# EAGLE schematic RouterPi (EAGLE 9.6.2)
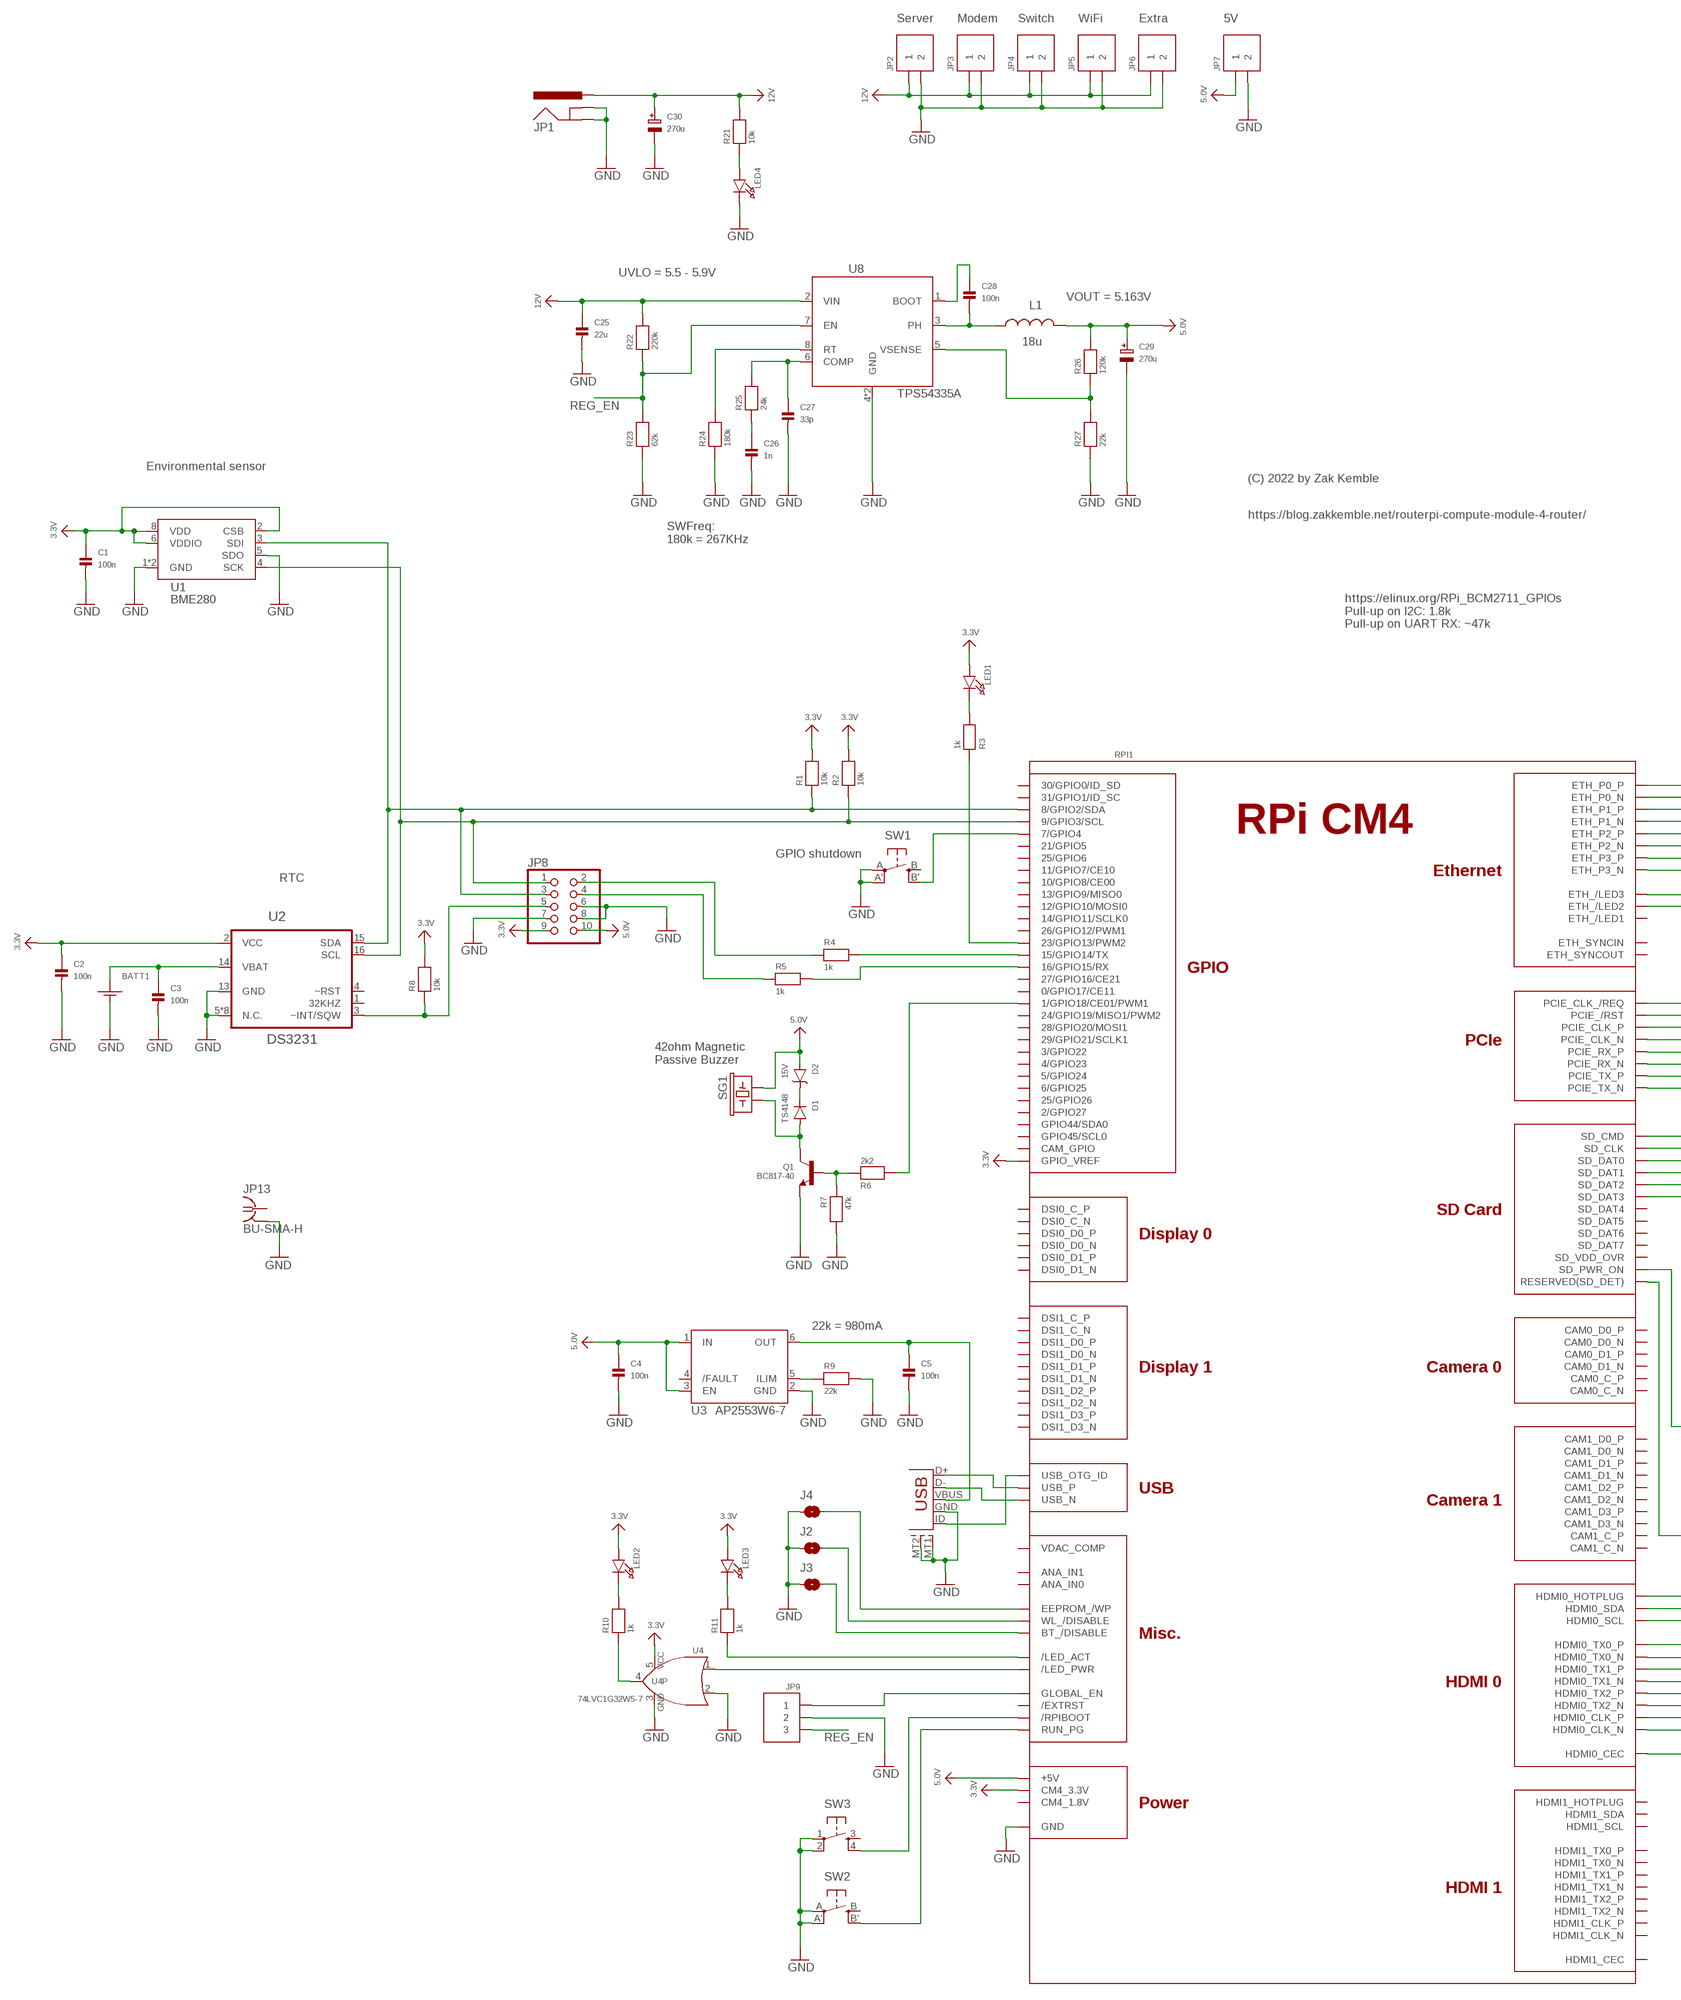
[diagram p0: schematic, sheet 1, part 1 of 2]
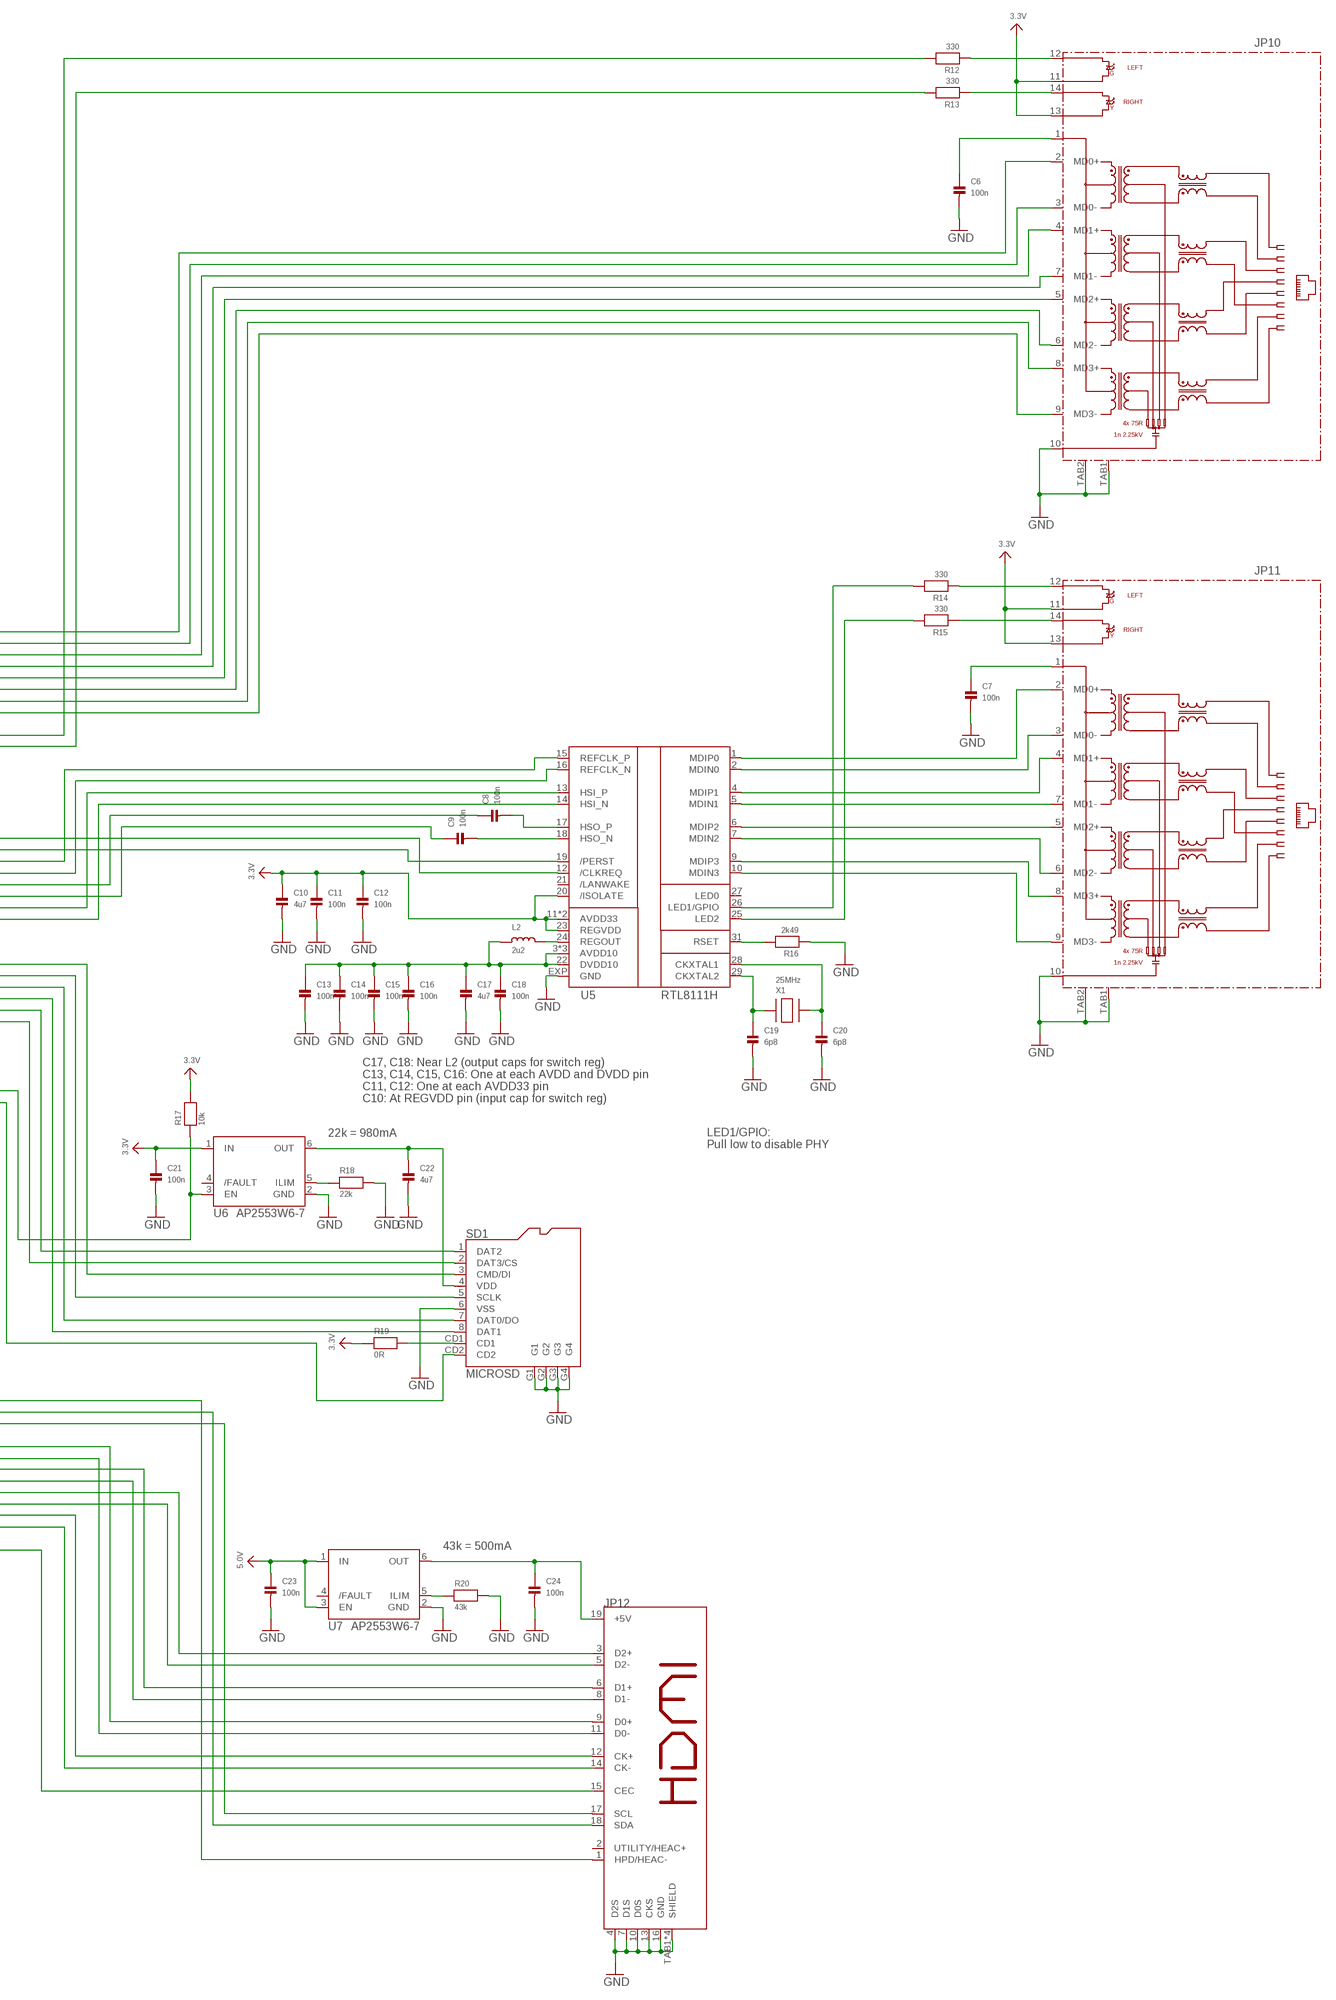
[diagram p1: schematic, sheet 1, part 2 of 2]

## Parts
BATT1  BATTERY_CR927  [BATTERY_CR927]
C1  100n  CAP_CERAMIC0402_XSMALL  [0402_XSMALL]
C2  100n  CAP_CERAMIC0402_XSMALL  [0402_XSMALL]
C3  100n  CAP_CERAMIC0402_XSMALL  [0402_XSMALL]
C4  100n  CAP_CERAMIC0402_XSMALL  [0402_XSMALL]
C5  100n  CAP_CERAMIC0402_XSMALL  [0402_XSMALL]
C6  100n  CAP_CERAMIC0402_XSMALL  [0402_XSMALL]
C7  100n  CAP_CERAMIC0402_XSMALL  [0402_XSMALL]
C8  100n  CAP_CERAMIC0402_XSMALL  [0402_XSMALL]
C9  100n  CAP_CERAMIC0402_XSMALL  [0402_XSMALL]
C10  4u7  CAP_CERAMIC_0603MP  [_0603MP]
C11  100n  CAP_CERAMIC0402_XSMALL  [0402_XSMALL]
C12  100n  CAP_CERAMIC0402_XSMALL  [0402_XSMALL]
C13  100n  CAP_CERAMIC0402_XSMALL  [0402_XSMALL]
C14  100n  CAP_CERAMIC0402_XSMALL  [0402_XSMALL]
C15  100n  CAP_CERAMIC0402_XSMALL  [0402_XSMALL]
C16  100n  CAP_CERAMIC0402_XSMALL  [0402_XSMALL]
C17  4u7  CAP_CERAMIC_0603MP  [_0603MP]
C18  100n  CAP_CERAMIC0402_XSMALL  [0402_XSMALL]
C19  6p8  CAP_CERAMIC0402_XSMALL  [0402_XSMALL]
C20  6p8  CAP_CERAMIC0402_XSMALL  [0402_XSMALL]
C21  100n  CAP_CERAMIC0402_XSMALL  [0402_XSMALL]
C22  4u7  CAP_CERAMIC_0603MP  [_0603MP]
C23  100n  CAP_CERAMIC0402_XSMALL  [0402_XSMALL]
C24  100n  CAP_CERAMIC0402_XSMALL  [0402_XSMALL]
C25  22u  CAP_CERAMIC1210  [1210K]
C26  1n  CAP_CERAMIC0402_XSMALL  [0402_XSMALL]
C27  33p  CAP_CERAMIC0402_XSMALL  [0402_XSMALL]
C28  100n  CAP_CERAMIC0402_XSMALL  [0402_XSMALL]
C29  270u  CAP_ELECTROLYTICPANASONIC_D  [PANASONIC_D]
C30  270u  CAP_ELECTROLYTICPANASONIC_D  [PANASONIC_D]
D1  TS4148  DIODE0805  [0805_DIODE]
D2  15V  DIODE-ZENERSOT-23-SLIM  [SOT-23-SLIMPAD]
J2  JUMPERSMALL  [JUMPER_SMALL]
J3  JUMPERSMALL  [JUMPER_SMALL]
J4  JUMPERSMALL  [JUMPER_SMALL]
JP1  POWER_JACKPTH_HIGHCURRENT  [POWER_JACK_PTH_HIGHCURRENT]
JP2  2WAY  [2WAY]
JP3  2WAY  [2WAY]
JP4  2WAY  [2WAY]
JP5  2WAY  [2WAY]
JP6  2WAY  [2WAY]
JP7  2WAY  [2WAY]
JP8  PINHD-2X5  [2X05]
JP9  HEADER_3WAY2.0MM  [HEADER_2.0_3WAY]
JP10  RJ45_MAG_MOLEX_93626  [RJ45_MAG_MOLEX_93626]
JP11  RJ45_MAG_MOLEX_93626  [RJ45_MAG_MOLEX_93626]
JP12  HDMIMICRO2  [HDMI_MICRO2]
JP13  BU-SMA-H  [BU-SMA-H]
L1  18u  INDUCTORPWR  [CDRH125]
L2  2u2  INDUCTOR3X3_SM  [INDUCTOR_3X3MM_SM]
LED1  LED0603_NOOUTLINE  [CHIPLED_0603_NOOUTLINE]
LED2  LED0603_NOOUTLINE  [CHIPLED_0603_NOOUTLINE]
LED3  LED0603_NOOUTLINE  [CHIPLED_0603_NOOUTLINE]
LED4  LED0603_NOOUTLINE  [CHIPLED_0603_NOOUTLINE]
Q1  BC817-40  TRANSISTOR_NPN  [SOT23-R]
R1  10k  RESISTOR0402_XSMALL  [0402_XSMALL]
R2  10k  RESISTOR0402_XSMALL  [0402_XSMALL]
R3  1k  RESISTOR0402_XSMALL  [0402_XSMALL]
R4  1k  RESISTOR0402_XSMALL  [0402_XSMALL]
R5  1k  RESISTOR0402_XSMALL  [0402_XSMALL]
R6  2k2  RESISTOR0402_XSMALL  [0402_XSMALL]
R7  47k  RESISTOR0402_XSMALL  [0402_XSMALL]
R8  10k  RESISTOR0402_XSMALL  [0402_XSMALL]
R9  22k  RESISTOR0402_XSMALL  [0402_XSMALL]
R10  1k  RESISTOR0402_XSMALL  [0402_XSMALL]
R11  1k  RESISTOR0402_XSMALL  [0402_XSMALL]
R12  330  RESISTOR0402_XSMALL  [0402_XSMALL]
R13  330  RESISTOR0402_XSMALL  [0402_XSMALL]
R14  330  RESISTOR0402_XSMALL  [0402_XSMALL]
R15  330  RESISTOR0402_XSMALL  [0402_XSMALL]
R16  2k49  RESISTOR0402_XSMALL  [0402_XSMALL]
R17  10k  RESISTOR0402_XSMALL  [0402_XSMALL]
R18  22k  RESISTOR0402_XSMALL  [0402_XSMALL]
R19  0R  RESISTOR0402_XSMALL  [0402_XSMALL]
R20  43k  RESISTOR0402_XSMALL  [0402_XSMALL]
R21  10k  RESISTOR0402_XSMALL  [0402_XSMALL]
R22  220k  RESISTOR0402_XSMALL  [0402_XSMALL]
R23  62k  RESISTOR0402_XSMALL  [0402_XSMALL]
R24  180k  RESISTOR0402_XSMALL  [0402_XSMALL]
R25  24k  RESISTOR0402_XSMALL  [0402_XSMALL]
R26  120k  RESISTOR0402_XSMALL  [0402_XSMALL]
R27  22k  RESISTOR0402_XSMALL  [0402_XSMALL]
RPI1  RPI_CM4RPI_CM4  [RPI_CM4]
SD1  MICROSD  [MICROSD]
SG1  BUZZERPTH  [BUZZER-12MM]
SW1  SPST_TACTMC32882  [TACT_SMD4]
SW2  SPST_TACTMC32882  [TACT_SMD4]
SW3  SPST_TACTG75_3X4  [TACT_SMD5]
U1  BME280  [BME280]
U2  DS3231  DS3231SN  [SOIC127P1032X265-16N]
U3  AP2553W6-7  AP2553SOT23-6  [SOT23-6_SM_PAD]
U4  74LVC1G32W5-7  74LVC1G32W5SOT23-5  [SOT23-5_SM_PAD]
U5  RTL8111H  RTL8111  [QFN32-4X4-0.4]
U6  AP2553W6-7  AP2553SOT23-6  [SOT23-6_SM_PAD]
U7  AP2553W6-7  AP2553SOT23-6  [SOT23-6_SM_PAD]
U8  TPS54335A  [SOIC8_150MIL_EXPPAD]
USB1  USB-MICROBLARGEPAD  [USB-MICROB_LARGEPAD]
X1  25MHz  XTAL2016  [2016_XTAL]

## Nets
3.3V: C1.1 C2.1 C10.1 C11.1 C12.1 C21.1 JP8.9 JP10.11(LED_L_A) JP10.13(LED_R_A) JP11.11(LED_L_A) JP11.13(LED_R_A) LED1.A LED2.A LED3.A R1.2 R2.2 R8.2 R17.2 R19.1 RPI1.78(GPIO_VREF) RPI1.84(CM4_3.3V) RPI1.86(CM4_3.3V) U1.2(CSB) U1.6(VDDIO) U1.8(VDD) U2.2(VCC) U4.5(VCC) U5.11(AVDD33) U5.20(/ISOLATE) U5.23(REGVDD) U5.32(AVDD33) U6.1(IN)
5.0V: C4.1 C23.1 C29.+ D2.2(A) JP7.P$1 JP8.10 L1.2 R26.2 RPI1.77(+5V) RPI1.79(+5V) RPI1.81(+5V) RPI1.83(+5V) RPI1.85(+5V) RPI1.87(+5V) SG1.+ U3.1(IN) U3.3(EN) U7.1(IN) U7.3(EN)
12V: C25.1 C30.+ JP1.PWR JP2.P$1 JP3.P$1 JP4.P$1 JP5.P$1 JP6.P$1 R21.2 R22.2 U8.2(VIN)
GND: BATT1.B-(NEG) C1.2 C2.2 C3.2 C4.2 C5.2 C6.2 C7.2 C10.2 C11.2 C12.2 C13.2 C14.2 C15.2 C16.2 C17.2 C18.2 C19.2 C20.2 C21.2 C22.2 C23.2 C24.2 C25.2 C26.2 C27.2 C29.- C30.- J2.1 J3.1 J4.1 JP1.C1(GNDBREAK) JP1.C2(GNDBREAK) JP1.C3(GNDBREAK) JP1.C4(GNDBREAK) JP1.GND JP2.P$2 JP3.P$2 JP4.P$2 JP5.P$2 JP6.P$2 JP7.P$2 JP8.6 JP8.7 JP8.8 JP9.2 JP10.10(GND) JP10.TAB1 JP10.TAB2 JP11.10(GND) JP11.TAB1 JP11.TAB2 JP12.4(D2S) JP12.7(D1S) JP12.10(D0S) JP12.13(CKS) JP12.16(GND) JP12.TAB1(SHIELD) JP12.TAB2(SHIELD) JP12.TAB3(SHIELD) JP12.TAB4(SHIELD) JP13.2 JP13.3 JP13.4 JP13.5 LED4.C Q1.2(E) R7.2 R9.2 R16.1 R18.2 R20.2 R23.1 R24.1 R27.1 RPI1.1(GND) RPI1.2(GND) RPI1.7(GND) RPI1.8(GND) RPI1.13(GND) RPI1.14(GND) RPI1.22(GND) RPI1.23(GND) RPI1.32(GND) RPI1.33(GND) RPI1.42(GND) RPI1.43(GND) RPI1.52(GND) RPI1.53(GND) RPI1.59(GND) RPI1.60(GND) RPI1.65(GND) RPI1.66(GND) RPI1.71(GND) RPI1.74(GND) RPI1.98(GND) RPI1.107(GND) RPI1.108(GND) RPI1.113(GND) RPI1.114(GND) RPI1.119(GND) RPI1.120(GND) RPI1.125(GND) RPI1.126(GND) RPI1.131(GND) RPI1.132(GND) RPI1.137(GND) RPI1.138(GND) RPI1.144(GND) RPI1.150(GND) RPI1.155(GND) RPI1.156(GND) RPI1.161(GND) RPI1.162(GND) RPI1.167(GND) RPI1.168(GND) RPI1.173(GND) RPI1.174(GND) RPI1.179(GND) RPI1.180(GND) RPI1.185(GND) RPI1.186(GND) RPI1.191(GND) RPI1.192(GND) RPI1.197(GND) RPI1.198(GND) SD1.6(VSS) SD1.G1 SD1.G2 SD1.G3 SD1.G4 SW1.A'(P1) SW1.A(P) SW2.A'(P1) SW2.A(P) SW3.1(P) SW3.2(P1) U1.1(GND) U1.5(SDO) U1.7(GND) U2.5(N.C.) U2.6(N.C.) U2.7(N.C.) U2.8(N.C.) U2.9(N.C.) U2.10(N.C.) U2.11(N.C.) U2.12(N.C.) U2.13(GND) U3.2(GND) U4.2(B) U4.3(GND) U5.EXP(GND) U6.2(GND) U7.2(GND) U8.4(GND) U8.EXPPAD(GND) USB1.GND USB1.MT1(SHEILD1) USB1.MT2(SHEILD2)
N$1: C28.1 U8.1(BOOT)
N$2: R10.1 U4.4(Y)
N$4: R24.2 U8.8(RT)
N$5: C27.1 R25.2 U8.6(COMP)
N$6: C26.1 R25.1
N$7: JP8.5 R8.1 U2.3(~INT/SQW)
N$8: JP12.9(D0+) RPI1.182(HDMI0_TX0_P)
N$9: JP8.3 R1.1 RPI1.58(8/GPIO2/SDA) U1.3(SDI) U2.15(SDA)
N$10: JP12.11(D0-) RPI1.184(HDMI0_TX0_N)
N$11: JP12.6(D1+) RPI1.176(HDMI0_TX1_P)
N$12: JP12.8(D1-) RPI1.178(HDMI0_TX1_N)
N$13: D1.1(A) Q1.3(C) SG1.-
N$14: C28.2 L1.1 U8.3(PH)
N$15: R26.1 R27.2 U8.5(VSENSE)
N$16: Q1.1(B) R6.1 R7.1
N$17: JP12.3(D2+) RPI1.170(HDMI0_TX2_P)
N$18: J3.2 RPI1.91(BT_/DISABLE)
N$19: J2.2 RPI1.89(WL_/DISABLE)
N$20: BATT1.B+(POS) C3.1 U2.14(VBAT)
N$21: JP12.5(D2-) RPI1.172(HDMI0_TX2_N)
N$22: JP8.2 R4.1
N$23: JP12.12(CK+) RPI1.188(HDMI0_CLK_P)
N$24: JP8.1 R2.1 RPI1.56(9/GPIO3/SCL) U1.4(SCK) U2.16(SCL)
N$25: JP12.14(CK-) RPI1.190(HDMI0_CLK_N)
N$26: R11.1 RPI1.21(/LED_ACT)
N$27: RPI1.95(/LED_PWR) U4.1(A)
N$28: JP9.1 RPI1.99(GLOBAL_EN)
N$29: RPI1.93(/RPIBOOT) SW3.4(S1)
N$30: LED4.A R21.1
N$31: D1.2(C) D2.1(C)
N$34: RPI1.92(RUN_PG) SW2.B'(S1)
N$35: L2.P$2 U5.24(REGOUT)
N$36: R16.2 U5.31(RSET)
N$37: C19.1 U5.29(CKXTAL2) X1.1
N$38: C20.1 U5.28(CKXTAL1) X1.3
N$40: JP11.2(MD0+) U5.1(MDIP0)
N$41: R15.2 U5.25(LED2)
N$42: R14.2 U5.26(LED1/GPIO)
N$44: JP11.3(MD0-) U5.2(MDIN0)
N$45: JP11.4(MD1+) U5.4(MDIP1)
N$46: JP11.7(MD1-) U5.5(MDIN1)
N$47: JP11.5(MD2+) U5.6(MDIP2)
N$48: JP11.6(MD2-) U5.7(MDIN2)
N$49: JP11.8(MD3+) U5.9(MDIP3)
N$50: JP11.9(MD3-) U5.10(MDIN3)
N$51: JP8.4 R5.1
N$52: RPI1.61(SD_DAT3) SD1.2(DAT3/CS)
N$53: C9.2 U5.18(HSO_N)
N$54: C8.1 RPI1.116(PCIE_RX_P)
N$55: RPI1.62(SD_CMD) SD1.3(CMD/DI)
N$56: RPI1.63(SD_DAT0) SD1.7(DAT0/DO)
N$57: C13.1 C14.1 C15.1 C16.1 C17.1 C18.1 L2.P$1 U5.3(AVDD10) U5.8(AVDD10) U5.22(DVDD10) U5.30(AVDD10)
N$58: JP10.12(LED_L_C) R12.1
N$59: C7.1 JP11.1(VCC)
N$60: C6.1 JP10.1(VCC)
N$61: J4.2 RPI1.20(EEPROM_/WP)
N$62: JP10.14(LED_R_C) R13.1
N$63: C5.1 U3.6(OUT) USB1.VBUS
N$64: RPI1.76(RESERVED(SD_DET)) SD1.CD2
N$65: JP12.15(CEC) RPI1.151(HDMI0_CEC)
N$66: JP12.17(SCL) RPI1.200(HDMI0_SCL)
N$67: JP12.18(SDA) RPI1.199(HDMI0_SDA)
N$68: JP12.1(HPD/HEAC-) RPI1.153(HDMI0_HOTPLUG)
N$69: R17.1 RPI1.75(SD_PWR_ON) U6.3(EN)
N$70: RPI1.102(PCIE_CLK_/REQ) U5.12(/CLKREQ)
N$71: RPI1.103(USB_N) USB1.D-
N$72: RPI1.105(USB_P) USB1.D+
N$73: RPI1.101(USB_OTG_ID) USB1.ID
N$74: RPI1.109(PCIE_/RST) U5.19(/PERST)
N$75: RPI1.110(PCIE_CLK_P) U5.15(REFCLK_P)
N$76: RPI1.112(PCIE_CLK_N) U5.16(REFCLK_N)
N$77: C8.2 U5.17(HSO_P)
N$78: C9.1 RPI1.118(PCIE_RX_N)
N$79: RPI1.122(PCIE_TX_P) U5.13(HSI_P)
N$80: RPI1.124(PCIE_TX_N) U5.14(HSI_N)
N$81: JP10.2(MD0+) RPI1.12(ETH_P0_P)
N$82: JP10.3(MD0-) RPI1.10(ETH_P0_N)
N$83: JP10.4(MD1+) RPI1.4(ETH_P1_P)
N$84: JP10.7(MD1-) RPI1.6(ETH_P1_N)
N$85: JP10.5(MD2+) RPI1.11(ETH_P2_P)
N$86: JP10.6(MD2-) RPI1.9(ETH_P2_N)
N$87: JP10.8(MD3+) RPI1.3(ETH_P3_P)
N$88: JP10.9(MD3-) RPI1.5(ETH_P3_N)
N$89: C24.1 JP12.19(+5V) U7.6(OUT)
N$90: C22.1 SD1.4(VDD) U6.6(OUT)
N$91: R6.2 RPI1.49(1/GPIO18/CE01/PWM1)
N$92: RPI1.54(7/GPIO4) SW1.B'(S1)
N$93: JP11.12(LED_L_C) R14.1
N$94: JP11.14(LED_R_C) R15.1
N$95: R4.2 RPI1.55(15/GPIO14/TX)
N$96: R5.2 RPI1.51(16/GPIO15/RX)
N$97: R12.2 RPI1.15(ETH_/LED3)
N$98: R13.2 RPI1.17(ETH_/LED2)
N$100: RPI1.67(SD_DAT1) SD1.8(DAT1)
N$101: RPI1.57(SD_CLK) SD1.5(SCLK)
N$102: RPI1.69(SD_DAT2) SD1.1(DAT2)
N$103: R3.1 RPI1.28(23/GPIO13/PWM2)
N$104: R9.1 U3.5(ILIM)
N$105: R20.1 U7.5(ILIM)
N$106: LED1.C R3.2
N$107: LED3.C R11.2
N$108: R18.1 U6.5(ILIM)
N$110: R19.2 SD1.CD1
N$111: LED2.C R10.2
REG_EN: JP9.3 R22.1 R23.2 U8.7(EN)
Unconnected: JP12.2(UTILITY/HEAC+) JP13.1 RPI1.16(ETH_SYNCIN) RPI1.18(ETH_SYNCOUT) RPI1.19(ETH_/LED1) RPI1.24(25/GPIO26) RPI1.25(29/GPIO21/SCLK1) RPI1.26(24/GPIO19/MISO1/PWM2) RPI1.27(28/GPIO20/MOSI1) RPI1.29(27/GPIO16/CE21) RPI1.30(25/GPIO6) RPI1.31(26/GPIO12/PWM1) RPI1.34(21/GPIO5) RPI1.35(31/GPIO1/ID_SC) RPI1.36(30/GPIO0/ID_SD) RPI1.37(11/GPIO7/CE10) RPI1.38(14/GPIO11/SCLK0) RPI1.39(10/GPIO8/CE00) RPI1.40(13/GPIO9/MISO0) RPI1.41(6/GPIO25) RPI1.44(12/GPIO10/MOSI0) RPI1.45(5/GPIO24) RPI1.46(3/GPIO22) RPI1.47(4/GPIO23) RPI1.48(2/GPIO27) RPI1.50(0/GPIO17/CE11) RPI1.64(SD_DAT5) RPI1.68(SD_DAT4) RPI1.70(SD_DAT7) RPI1.72(SD_DAT6) RPI1.73(SD_VDD_OVR) RPI1.80(GPIO45/SCL0) RPI1.82(GPIO44/SDA0) RPI1.88(CM4_1.8V) RPI1.90(CM4_1.8V) RPI1.94(ANA_IN1) RPI1.96(ANA_IN0) RPI1.97(CAM_GPIO) RPI1.100(/EXTRST) RPI1.111(VDAC_COMP) RPI1.115(CAM1_D0_N) RPI1.117(CAM1_D0_P) RPI1.121(CAM1_D1_N) RPI1.123(CAM1_D1_P) RPI1.127(CAM1_C_N) RPI1.128(DSI0_D0_N) RPI1.129(CAM1_C_P) RPI1.130(CAM0_D0_P) RPI1.133(CAM1_D2_N) RPI1.134(CAM0_D1_N) RPI1.135(CAM1_D2_P) RPI1.136(CAM0_D1_P) RPI1.139(CAM1_D3_N) RPI1.140(CAM0_C_N) RPI1.141(CAM1_D3_P) RPI1.142(CAM0_C_P) RPI1.143(HDMI1_HOTPLUG) RPI1.145(HDMI1_SDA) RPI1.146(HDMI1_TX2_P) RPI1.147(HDMI1_SCL) RPI1.148(HDMI1_TX2_N) RPI1.149(HDMI1_CEC) RPI1.152(HDMI1_TX1_P) RPI1.154(HDMI1_TX1_N) RPI1.157(CAM0_D0_N) RPI1.158(HDMI1_TX0_P) RPI1.159(DSI0_D0_P) RPI1.160(HDMI1_TX0_N) RPI1.163(DSI0_D1_N) RPI1.164(HDMI1_CLK_P) RPI1.165(DSI0_D1_P) RPI1.166(HDMI1_CLK_N) RPI1.169(DSI0_C_N) RPI1.171(DSI0_C_P) RPI1.175(DSI1_D0_N) RPI1.177(DSI1_D0_P) RPI1.181(DSI1_D1_N) RPI1.183(DSI1_D1_P) RPI1.187(DSI1_C_N) RPI1.189(DSI1_C_P) RPI1.193(DSI1_D2_N) RPI1.194(DSI1_D3_N) RPI1.195(DSI1_D2_P) RPI1.196(DSI1_D3_P) SW1.B(S) SW2.B(S) SW3.3(S) U2.1(32KHZ) U2.4(~RST) U3.4(/FAULT) U5.21(/LANWAKE) U5.27(LED0) U6.4(/FAULT) U7.4(/FAULT)

## Notes on the sheet
- Server | Modem | Switch | WiFi | Extra | 5V
- UVLO = 5.5 - 5.9V
- VOUT = 5.163V
- Environmental sensor
- (C) 2022 by Zak Kemble
- https://blog.zakkemble.net/routerpi-compute-module-4-router/
- SWFreq:
  180k = 267KHz
- https://elinux.org/RPi_BCM2711_GPIOs
  Pull-up on I2C: 1.8k
  Pull-up on UART RX: ~47k
- GPIO shutdown
- RTC
- 42ohm Magnetic
  Passive Buzzer
- C17, C18: Near L2 (output caps for switch reg)
  C13, C14, C15, C16: One at each AVDD and DVDD pin
  C11, C12: One at each AVDD33 pin
  C10: At REGVDD pin (input cap for switch reg)
- 22k = 980mA
- 22k = 980mA
- LED1/GPIO:
  Pull low to disable PHY
- 43k = 500mA

## Library data of the parts
BATT1 = zak:BATTERY_CR927
C1-C9 C11-C16 C18-C21 C23 C24 C26-C28 = zak:CAP_CERAMIC
C10 C17 = microbuilder:CAP_CERAMIC: Ceramic Capacitors 0402 - 0402 Surface Mount Capacitors 16pF 50V 5% [Digikey: 445-4899-2-ND] 18pF 50V 5% [Digikey: 490-1281-2-ND] 22pF 50V 5% [Digikey: 490-1283-2-ND] 68pF 50V 5% [Digikey: 490-1289-2-ND] 0.1uF 10V 10% [Digikey: 490-1318-2-ND] 1.0uF 6.3V 10% [Digikey: 490-1320-2-ND] 0603 - 0603 Surface Mount Capacitors 16 pF 50V 5% [Digikey: 445-5051-2-ND] 22 pF 50V [Digikey: PCC220ACVTR-ND] 33 pF 50V 5% [Digikey: 490-1415-1-ND] 56pF 50V 5% [Digikey: 490-1421-1-ND] 220pF 50V 5% [Digikey: 445-1285-1-ND] 680 pF 50V 2200 pF 50V 5% C0G [Digikey: 445-1297-1-ND] 5600 pF 100V 5% X7R [Digikey: 478-3711-1-ND] 0.1 µF 25V 10% [Digikey: PCC2277TR-ND] 0.22 µF 16V 10% X7R [Digikey: 445-1318-1-ND] 1.0 µF 25V 10% [Digikey: 445-5146-2-ND] 0603 - RF Specific 3pF 250V +/-0.1pF RF [Digikey: 712-1347-1-ND] 18 pF 250V 5% [Digikey: 478-3505-1-ND or 712-1322-1-ND] 56 pF 250V 5% C0G RF [Digikey: 490-4867-1-ND] 68 pF 250V RF [Digikey: 490-4868-1-ND] 0805 - 0805 Surface Mount Capacitors 220 pF 250V 2% RF Ceramic Capacitor [Digikey: 712-1398-1-ND] 1000 pF 50V 2% NP0 Ceramic Capacitor [Digikey: 478-3760-1-ND] 0.1 µF 25V 10% Ceramic Capacitor [Digikey: PCC1828TR-ND] 1.0 µF 16V 10% Ceramic Capacitor[Digikey: 490-1691-2-ND] 10.0 µF 10V 10% Ceramic Capacitor[Digikey: 709-1228-1-ND] 10.0 uF 16V 10% Ceramic Capacitor [Digikey: 478-5165-2-ND] 47 uF 6.3V 20% Ceramic Capacitor [Digikey: 587-1779-1-ND or 399-5506-1-ND] 1206 - 1206 Surface Mount Capacitors 47uF 10V 20% Ceramic Capacitor [Digikey: 490-5528-1-ND or 399-5508-1-ND or 445-6010-1-ND] 100uF 6.3V -20%, +80% Y5V Ceramic Capacitor (Digikey: 490-4512-1-ND, Mouser: 81-GRM31CF50J107ZE1L); FARNELL: 2611924
C22 = microbuilder:CAP_CERAMIC: Ceramic Capacitors 0402 - 0402 Surface Mount Capacitors 16pF 50V 5% [Digikey: 445-4899-2-ND] 18pF 50V 5% [Digikey: 490-1281-2-ND] 22pF 50V 5% [Digikey: 490-1283-2-ND] 68pF 50V 5% [Digikey: 490-1289-2-ND] 0.1uF 10V 10% [Digikey: 490-1318-2-ND] 1.0uF 6.3V 10% [Digikey: 490-1320-2-ND] 0603 - 0603 Surface Mount Capacitors 16 pF 50V 5% [Digikey: 445-5051-2-ND] 22 pF 50V [Digikey: PCC220ACVTR-ND] 33 pF 50V 5% [Digikey: 490-1415-1-ND] 56pF 50V 5% [Digikey: 490-1421-1-ND] 220pF 50V 5% [Digikey: 445-1285-1-ND] 680 pF 50V 2200 pF 50V 5% C0G [Digikey: 445-1297-1-ND] 5600 pF 100V 5% X7R [Digikey: 478-3711-1-ND] 0.1 µF 25V 10% [Digikey: PCC2277TR-ND] 0.22 µF 16V 10% X7R [Digikey: 445-1318-1-ND] 1.0 µF 25V 10% [Digikey: 445-5146-2-ND] 0603 - RF Specific 3pF 250V +/-0.1pF RF [Digikey: 712-1347-1-ND] 18 pF 250V 5% [Digikey: 478-3505-1-ND or 712-1322-1-ND] 56 pF 250V 5% C0G RF [Digikey: 490-4867-1-ND] 68 pF 250V RF [Digikey: 490-4868-1-ND] 0805 - 0805 Surface Mount Capacitors 220 pF 250V 2% RF Ceramic Capacitor [Digikey: 712-1398-1-ND] 1000 pF 50V 2% NP0 Ceramic Capacitor [Digikey: 478-3760-1-ND] 0.1 µF 25V 10% Ceramic Capacitor [Digikey: PCC1828TR-ND] 1.0 µF 16V 10% Ceramic Capacitor[Digikey: 490-1691-2-ND] 10.0 µF 10V 10% Ceramic Capacitor[Digikey: 709-1228-1-ND] 10.0 uF 16V 10% Ceramic Capacitor [Digikey: 478-5165-2-ND] 47 uF 6.3V 20% Ceramic Capacitor [Digikey: 587-1779-1-ND or 399-5506-1-ND] 1206 - 1206 Surface Mount Capacitors 47uF 10V 20% Ceramic Capacitor [Digikey: 490-5528-1-ND or 399-5508-1-ND or 445-6010-1-ND] 100uF 6.3V -20%, +80% Y5V Ceramic Capacitor (Digikey: 490-4512-1-ND, Mouser: 81-GRM31CF50J107ZE1L)
C25 = zak:CAP_CERAMIC; FARNELL: 2526285; MANU: TDK; PARTNUM: C3225X5R1C226M250AA
C29 C30 = zak:CAP_ELECTROLYTIC; FARNELL: 2491823; MANU: Panasonic; PARTNUM: 16SVPG270M
D1 = zak:DIODE: Diode in 0805 package
D2 = zak:DIODE-ZENER; PARTNUM: BZX84-C15
J2-J4 = zak:JUMPER
JP1 = zak:POWER_JACK
JP2-JP7 = zak-jst-xh:2WAY
JP8 = pinhead:PINHD-2X5: PIN HEADER
JP9 = zak:HEADER_3WAY
JP10 JP11 = zak:RJ45_MAG_MOLEX_93626; FARNELL: 2783897; MOLEX: 93626-3006
JP12 = zak:HDMI
JP13 = con-coax:BU-SMA-H: FEMALE SMA CONNECTOR Radiall; OC_FARNELL: unknown; OC_NEWARK: unknown
L1 = SparkFun-Passives:INDUCTOR: Inductors Basic Inductor/Choke - 0603 and 1206. Footprints are not proven and vary greatly between part numbers.; FARNELL: 2408814; MANU: BOURNS; PARTNUM: SRR1210-180M
L2 = zak:INDUCTOR; FARNELL: 2616857
LED1-LED4 = microbuilder:LED: LED 0603 - 0603 Surface Mount Package 2mA: Green LED - Low Power (3.9mcd, 2ma, 1.7Vf) - Digikey: 475-2709-2-ND Orange LED - Low Power (9.8mcd, 2ma, 1.8Vf) - Digikey: 475-1194-2-ND Red LED - Low Power (5mcd, 2ma, 1.8Vf) - Digikey: 475-1195-2-ND Yellow LED - Low Power (7mcd, 2ma, 1.8Vf) - Digikey: 475-1196-2-ND 5mA: Blue LED - Low Power (17mcd, 5ma, 2.9Vf) - Digikey: LNJ937W8CRACT-ND 0805 - 0805 Surface Mount Package 2mA: Red LED (8.8mcd, 2mA, 1.8Vf, Clear) - Low Power [Digikey: 475-2510-1-ND] Green LED (5mcd, 2mA, 1.8Vf, Clear) - Low Power [Digikey: 475-2730-1-ND] Yellow LED (11.3mcd, 2mA, 1.8Vf, Clear) - Low Power [Digikey: 475-2555-1-ND] 20mA: Red LED (104mcd, 20mA, Diffused) - LS R976 [Digikey: 475-1278-6-ND] Red LED (12mcd, 20mA, 2.0Vf, Clear) - APT2012EC [Digikey: 754-1128-1-ND] Green LED (15mcd, 20mA, 2.2Vf, Clear) - APT2012GC [Digikey: 754-1131-1-ND] Orange LED (160mcd, 20mA, 2.1Vf, Clear) - APT2012SECK [Digikey: 754-1130-1-ND] 1206 - 1206 Surface Mount Package Green LED (26mcd, 20mA, Diffused) - LG N971 [Digikey: 475-1407-6-ND] Red LED (15mcd, 20mA, Diffused) - LH N974 [Digikey: 475-1416-6-ND]
Q1 = microbuilder:TRANSISTOR_NPN: NPN Transistor Transistor (NPN) 500mA 45V - BC817 [Digikey: 568-1631-1-ND] Transistor (NPN) 500mA 45V - BC817,215 [Mouser: 771-BC817-T/R] SOT23-R - SOT23 footprint optimised for use with solder paste and reflow ovens. SOT23-W - SOT23 footprint optimised for hand-soldering (larger pads).
R1-R27 = zak:RESISTOR
RPI1 = RPi_CM4:RPI_CM4
SD1 = zak:MICROSD; FARNELL: 2293708; FARNELL2: 2666772
SG1 = SparkFun-Electromechanical:BUZZER: Buzzer 12mm Spark Fun Electronics SKU : Comp-Buzzer; ALIEXPRESS: https://www.aliexpress.com/item/4000115353540.html
SW1-SW3 = zak:SPST_TACT
U1 = zak:BME280
U2 = zak:DS3231SN
U3 U6 U7 = zak:AP2553
U4 = zak:74LVC1G32W5
U5 = zak:RTL8111
U8 = zak:TPS54335A
USB1 = zak:USB-MICROB
X1 = zak:XTAL; FARNELL: 2853847; PARTNO: MCSJK-7F-25.00-10-20-60-B-20